# Altium schematic sheet E77N.SchDoc
size 431 x 279 mm; SheetNumber: 1; SheetTotal: 1
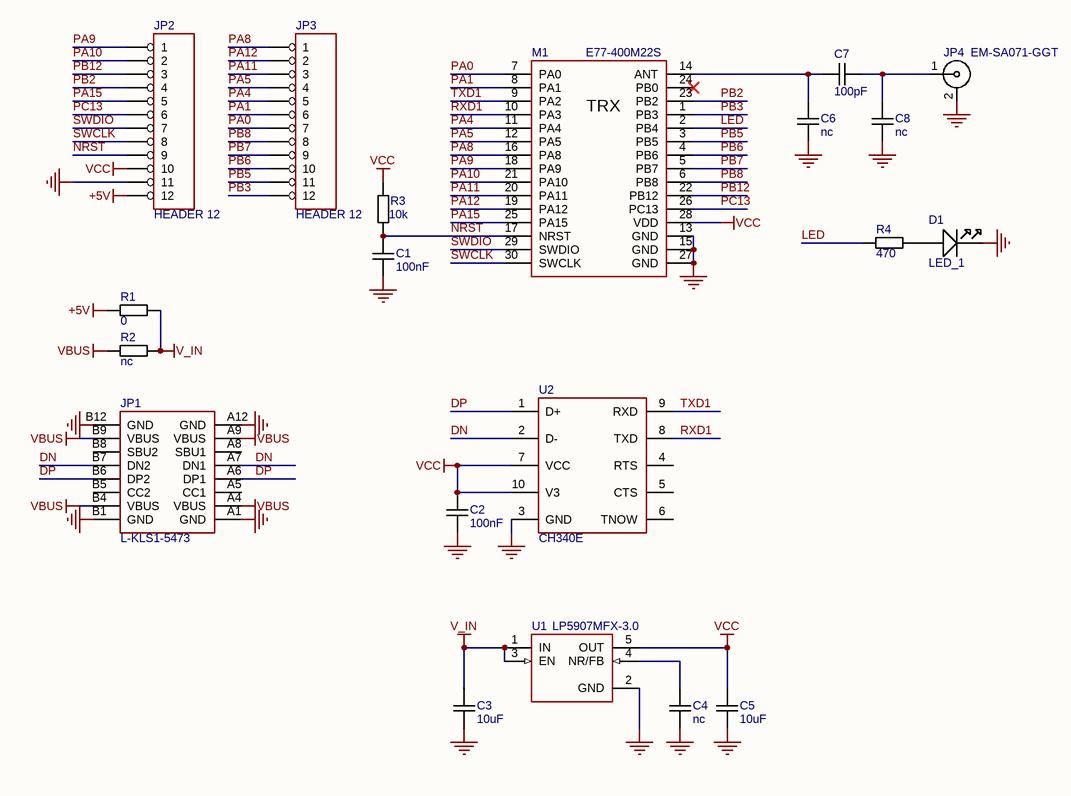
[diagram p0: E77N.SchDoc]

## Parts
C1  100nF  [C-0603]
C2  100nF  [C-0603]
C3  10uF  [C-0805]
C4  nc  [C-0603]
C5  10uF  [C-0805]
C6  nc  [C-0603]
C7  100pF  [C-0603]
C8  nc  [C-0603]
D1  LED_1  [LED_0805]
JP1  L-KLS1-5473  [USB_C_SMD_SLOT]
JP2  HEADER 12  [PLS1-12]
JP3  HEADER 12  [PLS1-12]
JP4  EM-SA071-GGT  [SMA_F_EDGE]
M1  E77-400M22S  [E77XX-M22]
R1  0  [R-0603]
R2  nc  [R-0603]
R3  10k  [R-0603]
R4  470  [R-0603]
U1  LP5907MFX-3.0  [SOT-23-5]
U2  CH340E  [MSOP-10]

## Nets
+5V: JP2.12 R1.1
GND: C1.1 C2.1 C3.2 C4.2 C5.2 C6.1 C8.1 D1.K(CATHODE) JP1.A1(GND) JP1.A12(GND) JP1.B1(GND) JP1.B12(GND) JP2.11 JP4.2 M1.13(GND) M1.15(GND) M1.27(GND) U1.2(GND) U2.3(GND)
V_IN: C3.1 R1.2 R2.2 U1.1(IN) U1.3(EN)
VBUS: JP1.A4(VBUS) JP1.A9(VBUS) JP1.B4(VBUS) JP1.B9(VBUS) R2.1
VCC: C2.2 C5.1 JP2.10 M1.28(VDD) R3.2 U1.5(OUT) U2.7(VCC) U2.10(V3)
DN: JP1.A7(DN1) JP1.B7(DN2) U2.2(D-)
DP: JP1.A6(DP1) JP1.B6(DP2) U2.1(D+)
LED: M1.2(PB4) R4.2
NRST: C1.2 JP2.9 M1.17(NRST) R3.1
PA0: JP3.7 M1.7(PA0)
PA1: JP3.6 M1.8(PA1)
PA4: JP3.5 M1.11(PA4)
PA5: JP3.4 M1.12(PA5)
PA8: JP3.1 M1.16(PA8)
PA9: JP2.1 M1.18(PA9)
PA10: JP2.2 M1.21(PA10)
PA11: JP3.3 M1.20(PA11)
PA12: JP3.2 M1.19(PA12)
PA15: JP2.5 M1.25(PA15)
PB2: JP2.4 M1.23(PB2)
PB3: JP3.12 M1.1(PB3)
PB5: JP3.11 M1.3(PB5)
PB6: JP3.10 M1.4(PB6)
PB7: JP3.9 M1.5(PB7)
PB8: JP3.8 M1.6(PB8)
PB12: JP2.3 M1.22(PB12)
PC13: JP2.6 M1.26(PC13)
RXD1: M1.10(PA3) U2.8(TXD)
SWCLK: JP2.8 M1.30(SWCLK)
SWDIO: JP2.7 M1.29(SWDIO)
TXD1: M1.9(PA2) U2.9(RXD)
NetC4_1: C4.1 U1.4(NR/FB)
NetC6_2: C6.2 C7.1 M1.14(ANT)
NetC7_2: C7.2 C8.2 JP4.1
NetD1_A: D1.A(ANODE) R4.1

Not connected (* = marked no-connect by the designer): JP1 17(VSS) A5(CC1) A8(SBU1) B5(CC2) B8(SBU2); M1 24(PB0)*; U2 4(RTS) 5(CTS) 6(TNOW)

## Notes on the sheet
- DWG. NO.
- REV.
- SHT.
- THIS DOCUMENT AND THE DATA DISCLOSED HEREIN OR HEREWITH IS THE PROPERTY OF ALTIUM LIMITED AND MAY BE FREELY DISTRIBUTED IN WHOLE. NO RIGHTS ARE RESERVED OR EXPRESS OR IMPLIED WARANTEE GIVEN.
- REVISION
- DESCRIPTION
- DATE
- APPROVED
- ENG:
- APPROVALS
- PROJECT
- DSN:
- CHK:
- REFERENCE DOCUMENTS
- PROJECT REVISION:
- TITLE
- DOCUMENT REVISION:
- DESIGN ITEM:
- BOM:
- FAB DWG:
- PCB DWG:
- ASSY DWG:
- SCALE:
- SIZE
- B
- CAGE CODE
- FILE NAME
- DWG NO.
- SHEET
- OF
- REV
- (in symbol E77-400M22S) TRX

## Library data of the parts
C1-C8 = CAPN: Voltage: 50V; Точність/група: NP0; Вид: Конденсатор
D1 = LED_1: Вид: Світлодіод
JP1 = L-KLS1-5473: Mounting  Method: SMD; Value: *
JP2 JP3 = HEADER 12: Вид: Роз'єм; *: *
JP4 = SMA: SMA Female R/A PCB Mount; Вид: Роз'єм
R1-R4 = RES: Точність/група: 5%; Вид: Резистор
U1 = LP5907: 250mA Low-Dropout Regulator; Вид: Мікросхема
U2 = CH340E: Value: {Value}; Mounting  Method: SMD